# EAGLE design ottawa-badge-2015-r1 (EAGLE 5.12)
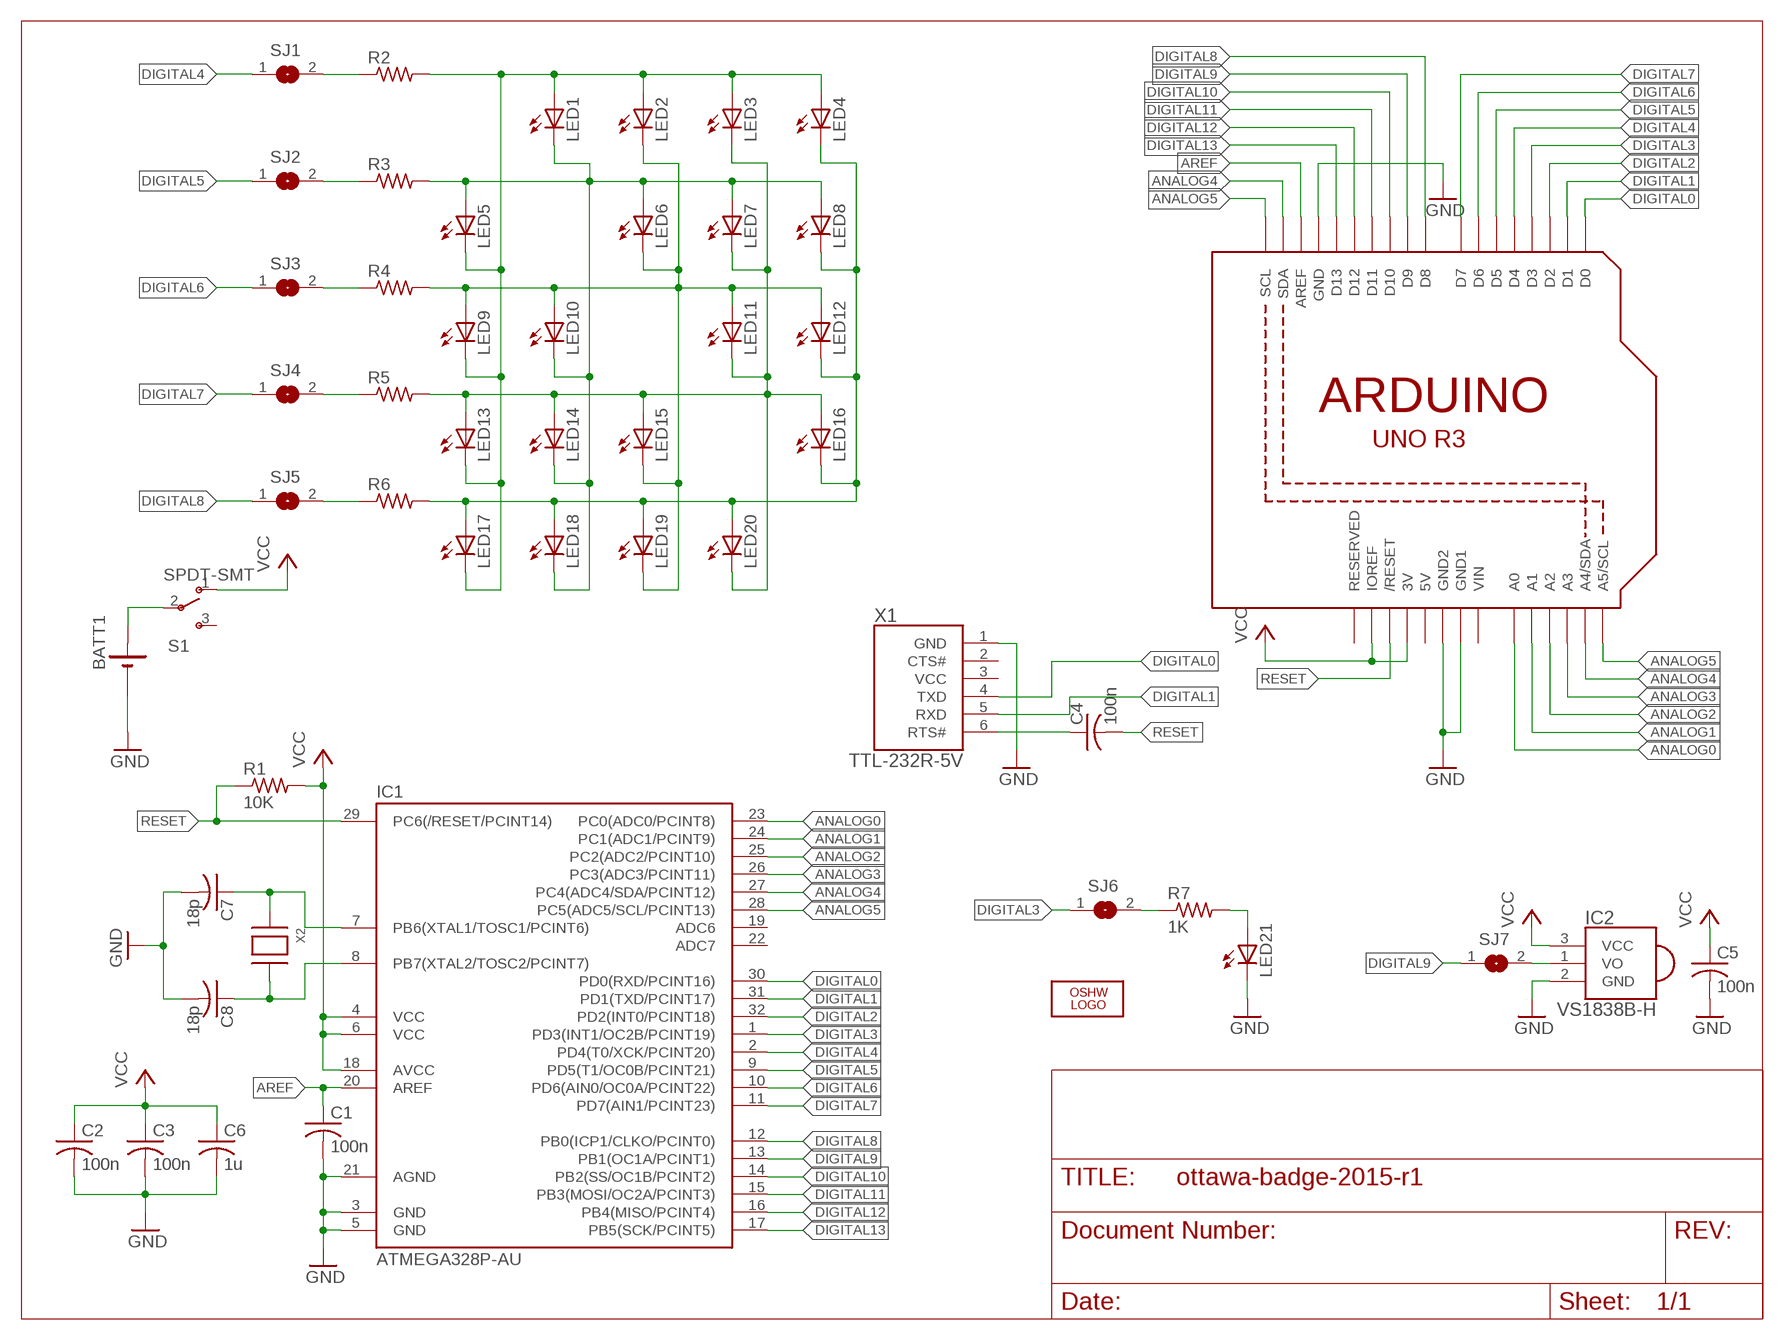
[diagram p0: schematic, sheet 1]

## Parts
BATT1  2032SMD  [2032SMD]
C1  100n  C-USC0603  [C0603]
C2  100n  C-USC0603  [C0603]
C3  100n  C-USC0603  [C0603]
C4  100n  C-USC0603  [C0603]
C5  100n  C-USC0603  [C0603]
C6  1u  C-USC0603  [C0603]
C7  18p  C-USC0603  [C0603]
C8  18p  C-USC0603  [C0603]
IC1  ATMEGA328P-AU  MEGA48/88/168-AU  [TQFP32-08]
IC2  VS1838B-H  [VS1838B-H]
LED1  LEDCHIP-LED0603  [CHIP-LED0603]
LED2  LEDCHIP-LED0603  [CHIP-LED0603]
LED3  LEDCHIP-LED0603  [CHIP-LED0603]
LED4  LEDCHIP-LED0603  [CHIP-LED0603]
LED5  LEDCHIP-LED0603  [CHIP-LED0603]
LED6  LEDCHIP-LED0603  [CHIP-LED0603]
LED7  LEDCHIP-LED0603  [CHIP-LED0603]
LED8  LEDCHIP-LED0603  [CHIP-LED0603]
LED9  LEDCHIP-LED0603  [CHIP-LED0603]
LED10  LEDCHIP-LED0603  [CHIP-LED0603]
LED11  LEDCHIP-LED0603  [CHIP-LED0603]
LED12  LEDCHIP-LED0603  [CHIP-LED0603]
LED13  LEDCHIP-LED0603  [CHIP-LED0603]
LED14  LEDCHIP-LED0603  [CHIP-LED0603]
LED15  LEDCHIP-LED0603  [CHIP-LED0603]
LED16  LEDCHIP-LED0603  [CHIP-LED0603]
LED17  LEDCHIP-LED0603  [CHIP-LED0603]
LED18  LEDCHIP-LED0603  [CHIP-LED0603]
LED19  LEDCHIP-LED0603  [CHIP-LED0603]
LED20  LEDCHIP-LED0603  [CHIP-LED0603]
LED21  LED5MM  [LED5MM]
LOGO1  OSHW_LOGO_FILLX0150-NT  [OSHW_FILLX150_NOTEXT]
R1  10K  R-US_R0603  [R0603]
R2  R-US_R0603  [R0603]
R3  R-US_R0603  [R0603]
R4  R-US_R0603  [R0603]
R5  R-US_R0603  [R0603]
R6  R-US_R0603  [R0603]
R7  1K  R-US_R0603  [R0603]
S1  SPDT-SMT  [SPDT-SMT]
SJ1  SJ  [SJ]
SJ2  SJ  [SJ]
SJ3  SJ  [SJ]
SJ4  SJ  [SJ]
SJ5  SJ  [SJ]
SJ6  SJ  [SJ]
SJ7  SJ  [SJ]
U1  ARDUINOR3-NOISP  [ARDUINOR3-NOISP]
X1  TTL-232R-5V  [USBCABLE-0.100]
X2  XTALNX5032  [NX5032]

## Nets
ANALOG0: IC1.23(PC0(ADC0/PCINT8)) U1.A0
ANALOG1: IC1.24(PC1(ADC1/PCINT9)) U1.A1
ANALOG2: IC1.25(PC2(ADC2/PCINT10)) U1.A2
ANALOG3: IC1.26(PC3(ADC3/PCINT11)) U1.A3
ANALOG4: IC1.27(PC4(ADC4/SDA/PCINT12)) U1.A4(A4/SDA) U1.SDA
ANALOG5: IC1.28(PC5(ADC5/SCL/PCINT13)) U1.A5(A5/SCL) U1.SCL
AREF: C1.1 IC1.20(AREF) U1.AREF
CHARLIEPLEX1: LED1.A LED2.A LED3.A LED4.A LED5.C LED9.C LED13.C LED17.C R2.2
CHARLIEPLEX2: LED1.C LED5.A LED6.A LED7.A LED8.A LED10.C LED14.C LED18.C R3.2
CHARLIEPLEX3: LED2.C LED6.C LED9.A LED10.A LED11.A LED12.A LED15.C LED19.C R4.2
CHARLIEPLEX4: LED3.C LED7.C LED11.C LED13.A LED14.A LED15.A LED16.A LED20.C R5.2
CHARLIEPLEX5: LED4.C LED8.C LED12.C LED16.C LED17.A LED18.A LED19.A LED20.A R6.2
DIGITAL0: IC1.30(PD0(RXD/PCINT16)) U1.D0 X1.4(TXD)
DIGITAL1: IC1.31(PD1(TXD/PCINT17)) U1.D1 X1.5(RXD)
DIGITAL2: IC1.32(PD2(INT0/PCINT18)) U1.D2
DIGITAL3: IC1.1(PD3(INT1/OC2B/PCINT19)) SJ6.1 U1.D3
DIGITAL4: IC1.2(PD4(T0/XCK/PCINT20)) SJ1.1 U1.D4
DIGITAL5: IC1.9(PD5(T1/OC0B/PCINT21)) SJ2.1 U1.D5
DIGITAL6: IC1.10(PD6(AIN0/OC0A/PCINT22)) SJ3.1 U1.D6
DIGITAL7: IC1.11(PD7(AIN1/PCINT23)) SJ4.1 U1.D7
DIGITAL8: IC1.12(PB0(ICP1/CLKO/PCINT0)) SJ5.1 U1.D8
DIGITAL9: IC1.13(PB1(OC1A/PCINT1)) SJ7.1 U1.D9
DIGITAL10: IC1.14(PB2(SS/OC1B/PCINT2)) U1.D10
DIGITAL11: IC1.15(PB3(MOSI/OC2A/PCINT3)) U1.D11
DIGITAL12: IC1.16(PB4(MISO/PCINT4)) U1.D12
DIGITAL13: IC1.17(PB5(SCK/PCINT5)) U1.D13
GND: BATT1.- C1.2 C2.2 C3.2 C5.2 C6.2 C7.2 C8.2 IC1.3(GND) IC1.5(GND) IC1.21(AGND) IC2.2(GND) LED21.K(C) U1.GND U1.GND1 U1.GND2 X1.1(GND)
N$1: R2.1 SJ1.2
N$3: R3.1 SJ2.2
N$5: R4.1 SJ3.2
N$6: BATT1.+ S1.2(P)
N$7: R5.1 SJ4.2
N$8: R7.1 SJ6.2
N$9: R6.1 SJ5.2
N$10: C7.1 IC1.7(PB6(XTAL1/TOSC1/PCINT6)) X2.P$1
N$11: IC2.1(VO) SJ7.2
N$12: C4.1 X1.6(RTS#)
N$18: C8.1 IC1.8(PB7(XTAL2/TOSC2/PCINT7)) X2.P$2
N$29: LED21.A R7.2
RESET: C4.2 IC1.29(PC6(/RESET/PCINT14)) R1.1 U1.RESET(/RESET)
VCC: C2.1 C3.1 C5.1 C6.1 IC1.4(VCC) IC1.6(VCC) IC1.18(AVCC) IC2.3(VCC) R1.2 S1.1(O) U1.3V U1.IOREF
Unconnected: IC1.19(ADC6) IC1.22(ADC7) S1.3(S) U1.RESERVED X1.2(CTS#) X1.3(VCC)

## Power pins joined to a net without a drawn wire
5V: U1.5V
VIN: U1.VIN

## Library data of the parts
BATT1 = rbg-4ucon-battery:2032SMD
C1-C8 = rcl:C-US: CAPACITOR, American symbol
IC1 = avr-4:MEGA48/88/168
IC2 = rbg-china-vs1838b:VS1838B
LED1-LED21 = led:LED: LED OSRAM: - CHIPLED LG R971, LG N971, LY N971, LG Q971, LY Q971, LO R971, LY R971 LH N974, LH R974 LS Q976, LO Q976, LY Q976 LO Q996 - Hyper CHIPLED LW Q18S LB Q993, LB Q99A, LB R99A - SideLED LS A670, LO A670, LY A670, LG A670, LP A670 LB A673, LV A673, LT A673, LW A673 LH A674 LY A675 LS A676, LA A676, LO A676, LY A676, LW A676 LS A679, LY A679, LG A679 - Hyper Micro SIDELED® LS Y876, LA Y876, LO Y876, LY Y876 LT Y87S - SmartLED LW L88C, LW L88S LB L89C, LB L89S, LG L890 LS L89K, LO L89K, LY L89K LS L896, LA L896, LO L896, LY L896 - TOPLED LS T670, LO T670, LY T670, LG T670, LP T670 LSG T670, LSP T670, LSY T670, LOP T670, LYG T670 LG T671, LOG T671, LSG T671 LB T673, LV T673, LT T673, LW T673 LH T674 LS T676, LA T676, LO T676, LY T676, LB T676, LH T676, LSB T676, LW T676 LB T67C, LV T67C, LT T67C, LS T67K, LO T67K, LY T67K, LW E67C LS E67B, LA E67B, LO E67B, LY E67B, LB E67C, LV E67C, LT E67C LW T67C LS T679, LY T679, LG T679 LS T770, LO T770, LY T770, LG T770, LP T770 LB T773, LV T773, LT T773, LW T773 LH T774 LS E675, LA E675, LY E675, LS T675 LS T776, LA T776, LO T776, LY T776, LB T776 LHGB T686 LT T68C, LB T68C - Hyper Mini TOPLED® LB M676 - Mini TOPLED Santana® LG M470 LS M47K, LO M47K, LY M47K Source: http://www.osram.convergy.de LUXEON: - LUMILED® LXK2-PW12-R00, LXK2-PW12-S00, LXK2-PW14-U00, LXK2-PW14-V00 LXK2-PM12-R00, LXK2-PM12-S00, LXK2-PM14-U00 LXK2-PE12-Q00, LXK2-PE12-R00, LXK2-PE12-S00, LXK2-PE14-T00, LXK2-PE14-U00 LXK2-PB12-K00, LXK2-PB12-L00, LXK2-PB12-M00, LXK2-PB14-N00, LXK2-PB14-P00, LXK2-PB14-Q00 LXK2-PR12-L00, LXK2-PR12-M00, LXK2-PR14-Q00, LXK2-PR14-R00 LXK2-PD12-Q00, LXK2-PD12-R00, LXK2-PD12-S00 LXK2-PH12-R00, LXK2-PH12-S00 LXK2-PL12-P00, LXK2-PL12-Q00, LXK2-PL12-R00 Source: www.luxeon.com KINGBRIGHT: KA-3528ASYC Source: www.kingbright.com
LOGO1 = ohw-logo:OSHW_LOGO_FILL
R1-R7 = rcl:R-US_: RESISTOR, American symbol
S1 = smt-spdt-aliexpress:SPDT-SMT
SJ1-SJ7 = jumper:SJ: SMD solder JUMPER
U1 = rbg-arduino-shield:ARDUINOR3-NOISP
X1 = rbg-ftdi-usb:TTL-232R-5V
X2 = adafruit:XTAL: Low cost SMT crystals, no capacitors included http://www.ladyada.net/library/eagle

## Board
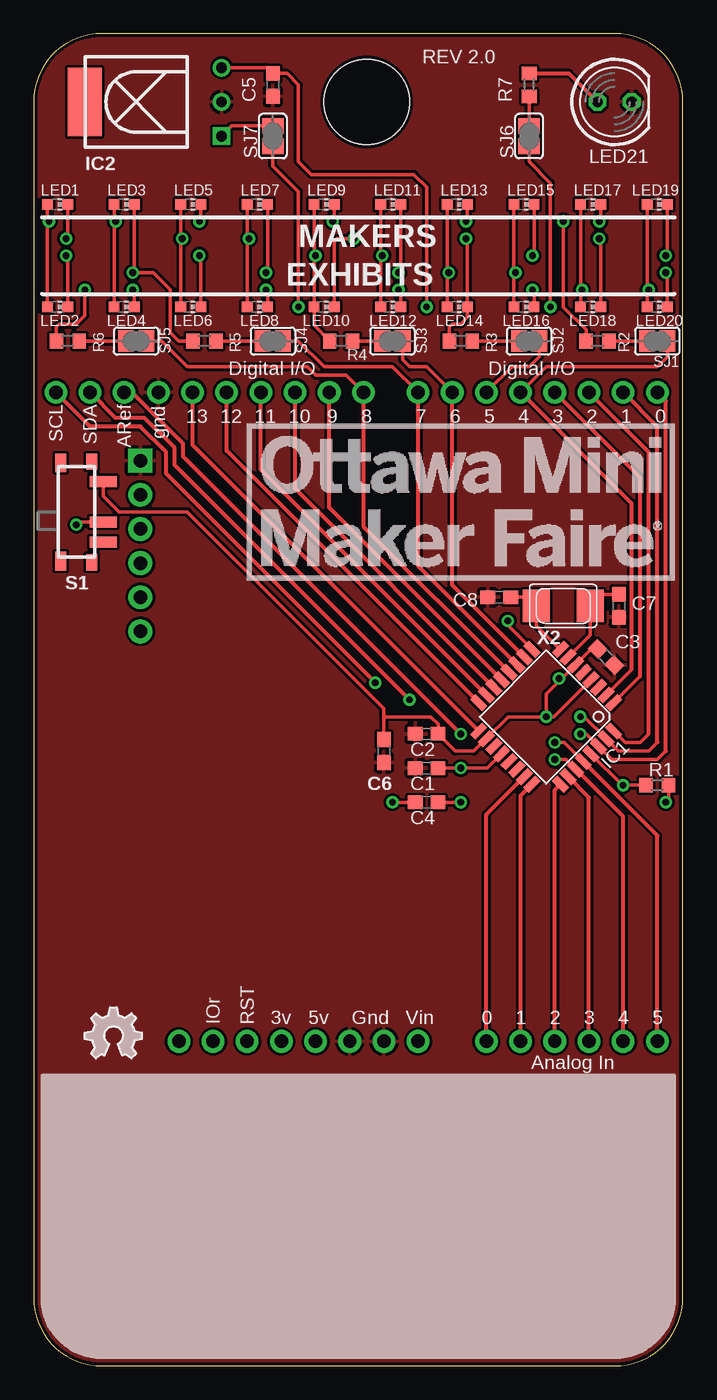
[diagram p1: board, top side]
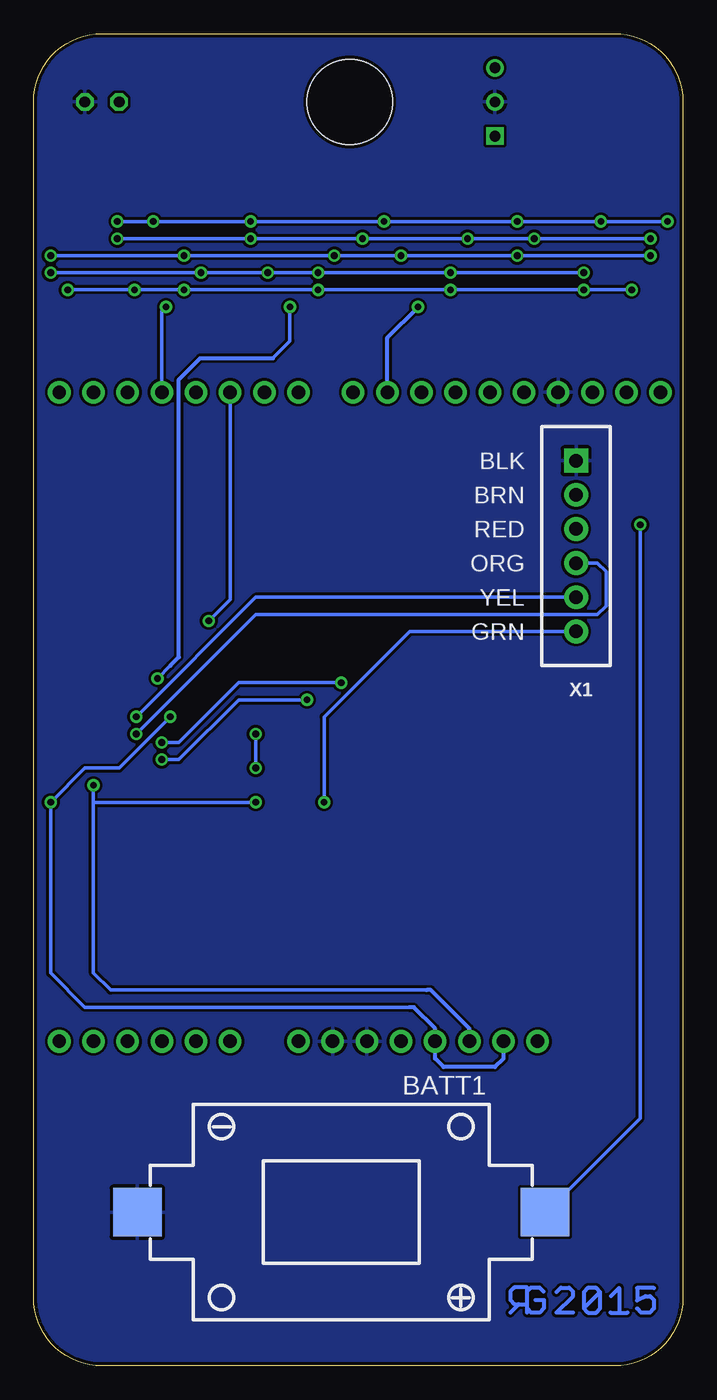
[diagram p2: board, bottom side, seen from below]

Size 48.26 x 99.06 mm. Coordinates in mm from the lower left corner, seen from the top.
Outline: 5.08,99.06 arc90 0,93.98 0,5.08 arc90 5.08,0 43.18,0 arc90 48.26,5.08 48.26,93.98 arc90 43.18,99.06 5.08,99.06
Copper layers (1*16): Top 0.035mm / dielectric 1.5mm / Bottom 0.035mm
Design rules "default *": minimum track width 10mil, minimum drill 0.5mm, track to track 8mil, track to pad 8mil, pad to pad 8mil, via to via 8mil, smd to smd 8mil, copper to edge 10mil, drill to drill 8mil, minimum pad ring 10mil, minimum via ring 8mil, stop-mask expansion 4mil, vias tented up to drill 20mil, thermal gap 10mil
Holes 6.35 mm at 24.77,93.98

### Footprints (pad centres in the part's own frame; a part is rotated, then mirrored left to right if it is on the bottom)
2032SMD = smd 3.6 x 3.6: + -15.15,0; - 15.15,0
C0603 = smd 1.1 x 1: 1 -0.85,0; 2 0.85,0
TQFP32-08 = smd 1.27 x 0.559: 1 -4.293,2.8; 2 -4.293,2; 3 -4.293,1.2; 4 -4.293,0.4; 5 -4.293,-0.4; 6 -4.293,-1.2; 7 -4.293,-2; 8 -4.293,-2.8; 17 4.293,-2.8; 18 4.293,-2; 19 4.293,-1.2; 20 4.293,-0.4; 21 4.293,0.4; 22 4.293,1.2; 23 4.293,2; 24 4.293,2.8 | smd 0.559 x 1.27: 9 -2.8,-4.293; 10 -2,-4.293; 11 -1.2,-4.293; 12 -0.4,-4.293; 13 0.4,-4.293; 14 1.2,-4.293; 15 2,-4.293; 16 2.8,-4.293; 25 2.8,4.293; 26 2,4.293; 27 1.2,4.293; 28 0.4,4.293; 29 -0.4,4.293; 30 -1.2,4.293; 31 -2,4.293; 32 -2.8,4.293
VS1838B-H = drill 0.8 square: 1 2.54,6.35 | drill 0.8 round: 2 0,6.35; 3 -2.54,6.35 | smd 5.08 x 2.54: CASE 0,-3.81
CHIP-LED0603 = smd 0.8 x 0.8: A 0,-0.75; C 0,0.75
LED5MM = drill 0.813 octagon: A -1.27,0; K 1.27,0
R0603 = smd 1 x 1.1: 1 -0.85,0; 2 0.85,0
SPDT-SMT = smd 2 x 0.8: 1 -2,-2.25; 2 -2,0.75; 3 -2,2.25 | smd 0.8 x 1.2: A -1.15,3.75; D -1.15,-3.75 | smd 0.8 x 1.4: B 1.15,3.65; C 1.15,-3.65
SJ = smd 1.168 x 1.6: 1 -0.762,0; 2 0.762,0
ARDUINOR3-NOISP = drill 1 pad 1.676 round: 3V 17.78,2.54; 5V 20.32,2.54; A0 33.02,2.54; A1 35.56,2.54; A2 38.1,2.54; A3 40.64,2.54; A4 43.18,2.54; A5 45.72,2.54; AREF 6.096,50.8; D0 45.72,50.8; D1 43.18,50.8; D2 40.64,50.8; D3 38.1,50.8; D4 35.56,50.8; D5 33.02,50.8; D6 30.48,50.8; D7 27.94,50.8; D8 23.876,50.8; D9 21.336,50.8; D10 18.796,50.8; D11 16.256,50.8; D12 13.716,50.8; D13 11.176,50.8; GND 8.636,50.8; GND1 25.4,2.54; GND2 22.86,2.54; IOREF 12.7,2.54; RESERVED 10.16,2.54; RESET 15.24,2.54; SCL 1.016,50.8; SDA 3.556,50.8; VIN 27.94,2.54
USBCABLE-0.100 = drill 1 pad 1.778 square: 1 0,-7.62 | drill 1 pad 1.778 round: 2 0,-5.08; 3 0,-2.54; 4 0,0; 5 0,2.54; 6 0,5.08
NX5032 = smd 2 x 2.4: P$1 2,0; P$2 -2,0

### Placement (x,y rotation side)
BATT1  25.4,11.43 180 bottom
C1  29.21,44.45 180 top
C2  29.21,46.99 180 top
C3  42.55,52.7 315 top
C4  29.21,41.91 0 top
C5  17.78,95.25 270 top
C6  26.04,45.72 270 top
C7  43.5,56.52 270 top
C8  34.61,57.15 180 top
IC1  38.1,48.26 225 top
IC2  7.62,93.98 270 top
LED1  1.78,86.36 270 top
LED2  1.78,78.74 270 top
LED3  6.73,86.36 270 top
LED4  6.73,78.74 270 top
LED5  11.68,86.36 270 top
LED6  11.68,78.74 270 top
LED7  16.64,86.36 270 top
LED8  16.64,78.74 270 top
LED9  21.59,86.36 270 top
LED10  21.59,78.74 270 top
LED11  26.54,86.36 270 top
LED12  26.54,78.74 270 top
LED13  31.5,86.36 270 top
LED14  31.5,78.74 270 top
LED15  36.45,86.36 270 top
LED16  36.45,78.74 270 top
LED17  41.4,86.36 270 top
LED18  41.4,78.74 270 top
LED19  46.35,86.36 270 top
LED20  46.35,78.74 270 top
LED21  43.18,93.98 0 top
LOGO1  3.81,22.86 0 top
R1  46.35,43.18 0 top
R2  41.91,76.2 180 top
R3  31.75,76.2 180 top
R4  22.86,76.2 180 top
R5  12.7,76.2 180 top
R6  2.54,76.2 180 top
R7  36.83,95.25 90 top
S1  3.17,63.5 180 top
SJ1  46.35,76.2 180 top
SJ2  36.83,76.2 180 top
SJ3  26.67,76.2 180 top
SJ4  17.78,76.2 180 top
SJ5  7.62,76.2 180 top
SJ6  36.83,91.44 90 top
SJ7  17.78,91.44 90 top
U1  0.64,21.59 0 top
U$1  [LOGO-400]  15.88,58.42 0 top
U$4  [RGLOGO_SMALL_2015]  11.43,3.81 0 bottom
X1  7.94,59.69 180 bottom
X2  39.37,56.52 0 top

### Tracks (layer width: path | path; a pad name or v marks a point on that pad's centre or on a via)
ANALOG0
  Top 0.305: U1.A0 33.66,40.99 IC1.23
ANALOG1
  Top 0.305: U1.A1 36.2,42.4 IC1.24
ANALOG2
  Top 0.305: U1.A2 38.73,42.82 IC1.25
ANALOG3
  Top 0.305: U1.A3 41.27,42.26 IC1.26
ANALOG4  (via drill 0.5)
  Top 0.254: IC1.27 39.58,45.09 v38.73,45.09
  Top 0.305: U1.A4 43.81,40.85 IC1.27 | U1.SDA 6.1,70.48 8.26,70.48 10.48,68.26 10.48,66.99 v27.94,49.53
  Bottom 0.254: v38.73,45.09 37.47,45.09 33.02,49.53 v27.94,49.53
ANALOG5  (via drill 0.5)
  Top 0.254: IC1.28 39.44,46.35 v38.73,46.35
  Top 0.305: U1.A5 46.35,39.44 IC1.28 | U1.SCL 4.19,69.85 7.94,69.85 9.84,67.94 9.84,66.36 v25.4,50.8
  Bottom 0.254: v38.73,46.35 37.47,46.35 33.02,50.8 v25.4,50.8
AREF  (via drill 0.5)
  Top 0.254: IC1.20 33.72,44.45 v31.75,44.45 C1.1
  Top 0.305: v31.75,46.99 11.11,67.63 11.11,68.58 7.3,72.39 U1.AREF
  Bottom 0.254: v31.75,44.45 v31.75,46.99
CHARLIEPLEX1  (via drill 0.5)
  Top 0.254: R2.2 41.06,77.05 39.37,78.74 v39.37,85.09 | LED2.A 1.03,84.97 v1.14,85.09 1.03,85.2 LED1.A | LED17.C 42.15,85.2 v42.04,85.09 | LED13.C 32.25,85.2 v32.13,85.09 | LED4.A 5.98,84.97 v6.1,85.09 5.98,85.2 LED3.A | LED5.C 12.43,85.2 v12.32,85.09 | LED9.C 22.34,85.2 v22.23,85.09
  Bottom 0.254: v1.14,85.09 v6.1,85.09 v12.32,85.09 v22.23,85.09 v32.13,85.09 v39.37,85.09 v42.04,85.09
CHARLIEPLEX2  (via drill 0.5)
  Top 0.254: LED1.C 2.53,83.94 v2.41,83.82 | LED18.C 42.15,83.7 v42.04,83.82 | v32.13,83.82 32.25,83.7 LED14.C 32.25,77.97 31.75,77.47 31.11,77.47 30.9,77.25 R3.2 | LED5.A 10.93,83.94 v11.05,83.82 10.93,83.7 LED6.A | LED7.A 15.89,83.94 v16,83.82 15.89,83.7 LED8.A | LED10.C 22.34,83.62 22.54,83.82 v23.81,83.82
  Bottom 0.254: v2.41,83.82 v11.05,83.82 v16,83.82 v23.81,83.82 v32.13,83.82 v42.04,83.82
CHARLIEPLEX3  (via drill 0.5)
  Top 0.254: LED2.C 2.53,82.44 v2.41,82.55 | LED19.C 47.1,82.67 v46.99,82.55 | LED15.C 37.2,82.67 v37.08,82.55 | LED11.A 25.79,82.67 v25.91,82.55 25.79,82.44 LED12.A | LED6.C 12.43,82.44 v12.32,82.55 | LED9.A 20.84,82.67 v20.95,82.55 20.84,82.44 LED10.A 20.84,77.37 R4.2
  Bottom 0.254: v2.41,82.55 v12.32,82.55 v20.95,82.55 v25.91,82.55 v37.08,82.55 v46.99,82.55
CHARLIEPLEX4  (via drill 0.5)
  Top 0.254: R5.2 10.79,76.2 10.16,76.83 10.16,80.01 8.89,81.28 v7.37,81.28 7.48,81.39 LED3.C | LED20.C 47.1,81.17 v46.99,81.28 | LED15.A 35.7,81.39 v35.81,81.28 35.7,81.17 LED16.A | LED14.A 30.75,81.17 v30.86,81.28 30.75,81.39 LED13.A | LED11.C 27.29,81.46 v27.11,81.28 | LED7.C 17.39,81.39 v17.27,81.28
  Bottom 0.254: v7.37,81.28 v17.27,81.28 v27.11,81.28 v30.86,81.28 v35.81,81.28 v46.99,81.28
CHARLIEPLEX5  (via drill 0.5)
  Top 0.254: v3.81,80.01 3.81,78.11 3.17,77.47 1.91,77.47 1.69,77.25 R6.2 | LED20.A 45.6,79.89 v45.72,80.01 45.6,80.12 LED19.A | LED17.A 40.65,80.12 v40.77,80.01 40.65,79.89 LED18.A | LED16.C 37.2,79.89 v37.08,80.01 | LED12.C 27.29,79.87 v27.11,80.01 | LED4.C 7.48,79.89 v7.37,80.01 | LED8.C 17.39,79.89 v17.27,80.01
  Bottom 0.254: v3.81,80.01 v7.37,80.01 v17.27,80.01 v27.11,80.01 v37.08,80.01 v40.77,80.01 v45.72,80.01
DIGITAL0  (via drill 0.5)
  Top 0.254: 46.99,45.72 46.35,45.09 42.97,45.09 IC1.30 41.07,46.99 v40.64,46.99
  Top 0.305: 46.99,45.72 46.99,71.75 U1.D0
  Bottom 0.254: v40.64,46.99 31.75,55.88 6.35,55.88 5.71,56.52 5.71,59.05 6.35,59.69 X1.4
DIGITAL1  (via drill 0.5)
  Top 0.254: 46.35,46.35 45.72,45.72 43.47,45.72 IC1.31 40.93,48.26 v40.64,48.26
  Top 0.305: 46.35,46.35 46.35,69.85 U1.D1
  Bottom 0.254: X1.5 31.75,57.15 v40.64,48.26
DIGITAL2
  Top 0.254: 45.72,46.99 45.09,46.35 43.97,46.35 IC1.32
  Top 0.305: 45.72,46.99 45.72,67.94 U1.D2
DIGITAL3  (via drill 0.5)
  Top 0.254: IC1.1 45.09,51.28 | v38.42,78.74 38.42,87.95 36.83,89.53 SJ6.1
  Top 0.305: 45.09,51.28 45.09,66.04 U1.D3
  Bottom 0.254: U1.D3 38.73,78.42 v38.42,78.74
DIGITAL4
  Top 0.254: IC1.2 44.45,51.78 | SJ1.1 47.12,75.06 46.35,74.3 38.1,74.3 U1.D4
  Top 0.305: 44.45,51.78 44.45,64.14 U1.D4
DIGITAL5  (via drill 0.5)
  Top 0.254: SJ2.1 37.59,75.06 36.83,74.3 35.56,74.3 U1.D5 | IC1.9 35.24,55.08 v35.24,55.4
  Bottom 0.254: U1.D5 33.66,56.98 v35.24,55.4
DIGITAL6
  Top 0.254: SJ3.1 27.43,74.8 27.94,74.3 29.21,74.3 U1.D6
  Top 0.305: U1.D6 31.11,58.07 IC1.10
DIGITAL7
  Top 0.254: SJ4.1 19.68,76.2 21.59,74.3 26.67,74.3 U1.D7
  Top 0.305: U1.D7 28.57,59.48 IC1.11
DIGITAL8
  Top 0.254: SJ5.1 9.53,76.2 11.43,74.3 20.32,74.3 20.95,73.66 23.24,73.66 U1.D8
  Top 0.305: U1.D8 24.51,62.41 IC1.12
DIGITAL9  (via drill 0.5)
  Top 0.254: v19.68,78.74 19.68,87.31 17.78,89.22 SJ7.1
  Top 0.305: U1.D9 21.97,63.82 IC1.13
  Bottom 0.305: v19.68,78.74 21.97,76.45 U1.D9
DIGITAL10
  Top 0.305: U1.D10 19.43,65.23 IC1.14
DIGITAL11
  Top 0.305: U1.D11 16.89,66.64 IC1.15
DIGITAL12
  Top 0.305: U1.D12 14.35,68.05 IC1.16
DIGITAL13
  Top 0.305: U1.D13 11.81,68.48 IC1.17
GND
  pour Top: -1.27,100.33 50.8,100.33 50.8,-1.27 -1.27,-1.27
  pour Bottom: -1.27,100.33 50.8,100.33 50.8,-1.27 -1.27,-1.27
N$1
  Top 0.254: R2.1 SJ1.2
N$2
  Top 0.203: 17.14,76.2 18.41,76.2
N$3
  Top 0.254: R3.1 SJ2.2
N$4
  Top 0.203: 6.99,76.2 8.26,76.2
N$5
  Top 0.254: R4.1 SJ3.2
N$6  (via drill 0.5)
  Top 0.254: S1.2 3.38,62.75 v3.17,62.55
  Bottom 0.254: BATT1.+ 10.16,11.43 3.17,18.41 v3.17,62.55
N$7
  Top 0.254: R5.1 SJ4.2
N$8
  Top 0.254: SJ6.2 R7.1
N$9
  Top 0.254: R6.1 SJ5.2
N$10
  Top 0.254: IC1.7 41.37,54.36 X2.P$1 42.22,57.37 C7.1
N$11
  Top 0.254: SJ7.2 14.73,92.2 IC2.1
N$12  (via drill 0.5)
  Top 0.254: v26.67,41.91 C4.1
  Bottom 0.254: v26.67,41.91 26.67,48.26 20.32,54.61 X1.6
N$13
  Top 0.203: 26.04,76.2 27.3,76.2
N$14
  Top 0.203: 36.2,76.2 37.47,76.2
N$15
  Top 0.203: 45.72,76.2 46.99,76.2
N$16
  Top 0.203: 36.83,90.81 36.83,92.08
N$17
  Top 0.203: 17.78,90.81 17.78,92.08
N$18
  Top 0.254: IC1.8 37.37,55.06 X2.P$2 36.73,57.15 C8.1
N$29
  Top 0.305: R7.2 39.79,96.1 LED21.A
RESET  (via drill 0.5)
  Top 0.254: IC1.29 43.75,43.18 v43.81,43.18 R1.1 | v31.75,41.91 C4.2
  Bottom 0.254: 19.05,27.94 42.55,27.94 43.81,29.21 43.81,41.91 | 43.81,41.91 v43.81,43.18 | 43.81,41.91 v31.75,41.91
  Bottom 0.305: 19.05,27.94 18.73,27.94 15.88,25.08 U1.RESET
VCC  (via drill 0.5)
  Top 0.254: IC1.4 38.67,48.26 v38.1,48.26 | v38.1,48.26 35.27,48.26 IC1.18 32.73,45.72 31.33,45.72 C2.1 30.06,47.73 29.53,48.26 26.04,48.26 | 39.16,51.01 38.1,49.96 v38.1,48.26 | 39.16,51.01 IC1.6 41.45,53.31 C3.1 | IC2.3 17.36,96.52 C5.1 18.84,96.1 19.68,95.25 19.68,89.53 20.64,88.58 28.26,88.58 29.21,87.63 v29.21,78.74 | R1.2 47.2,42.12 v46.99,41.91 | S1.1 5.17,64.67 6.35,63.5 11.43,63.5 26.04,48.9 26.04,48.26 | 26.04,48.26 C6.1 | v39.05,51.12 | 39.16,51.01 v39.05,51.12
  Bottom 0.254: v38.1,48.26 41.91,44.45 44.45,44.45 v46.99,41.91 46.99,29.21 44.45,26.67 20.32,26.67 | v29.21,78.74 29.21,76.2 30.48,74.93 | v39.05,51.12 38.1,52.07
  Bottom 0.305: 20.32,26.67 20,26.67 18.41,25.08 U1.3V 18.41,22.86 17.78,22.23 13.97,22.23 13.34,22.86 U1.IOREF | 30.48,74.93 35.88,74.93 37.47,73.34 37.47,52.7 38.1,52.07

### Text on the board
tNames: REV 2.0 | MAKERS | EXHIBITS